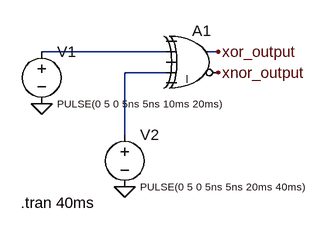
[diagram p0: schematic XOR & XNOR gate.asc]
XOR & XNOR gate.asc, the LTspice schematic file:
Version 4.1
SHEET 1 880 680
WIRE 160 112 -32 112
WIRE 240 112 224 112
WIRE 160 144 96 144
WIRE 96 240 96 144
FLAG -32 192 0
FLAG 96 320 0
FLAG 240 144 xnor_output
FLAG 240 112 xor_output
SYMBOL voltage -32 96 R0
WINDOW 3 24 96 Left 1
WINDOW 123 0 0 Left 0
WINDOW 39 0 0 Left 0
SYMATTR Value PULSE(0 5 0 5ns 5ns 10ms 20ms)
SYMATTR InstName V1
SYMBOL voltage 96 224 R0
WINDOW 3 24 96 Left 1
WINDOW 123 0 0 Left 0
WINDOW 39 0 0 Left 0
SYMATTR Value PULSE(0 5 0 5ns 5ns 20ms 40ms)
SYMATTR InstName V2
SYMBOL Digital\\xor 208 64 R0
SYMATTR InstName A1
TEXT -64 344 Left 2 !.tran 40ms

The netlist it stands for:
* XOR & XNOR gate.asc
V1 N001 0 PULSE(0 5 0 5ns 5ns 10ms 20ms)
V2 N002 0 PULSE(0 5 0 5ns 5ns 20ms 40ms)
A1 0 N001 0 N002 0 xnor_output xor_output 0 XOR
.tran 40ms
.backanno
.end